# EAGLE schematic hand r1 (EAGLE 7.5.0)
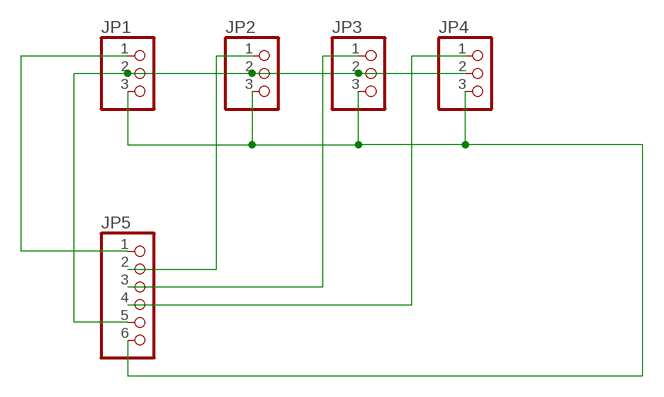
[diagram p0: schematic, sheet 1]

## Parts
JP1  PINHD-1X3  [1X03]
JP2  PINHD-1X3  [1X03]
JP3  PINHD-1X3  [1X03]
JP4  PINHD-1X3  [1X03]
JP5  PINHD-1X6  [1X06]

## Nets
N$1: JP1.3 JP2.3 JP3.3 JP4.3 JP5.6
N$4: JP1.2 JP2.2 JP3.2 JP4.2 JP5.5
N$5: JP4.1 JP5.4
N$6: JP3.1 JP5.3
N$7: JP2.1 JP5.2
N$8: JP1.1 JP5.1

## Library data of the parts
JP1-JP4 = pinhead:PINHD-1X3: PIN HEADER
JP5 = pinhead:PINHD-1X6: PIN HEADER